# Altium schematic sheet Protection_logic.SchDoc
size A3
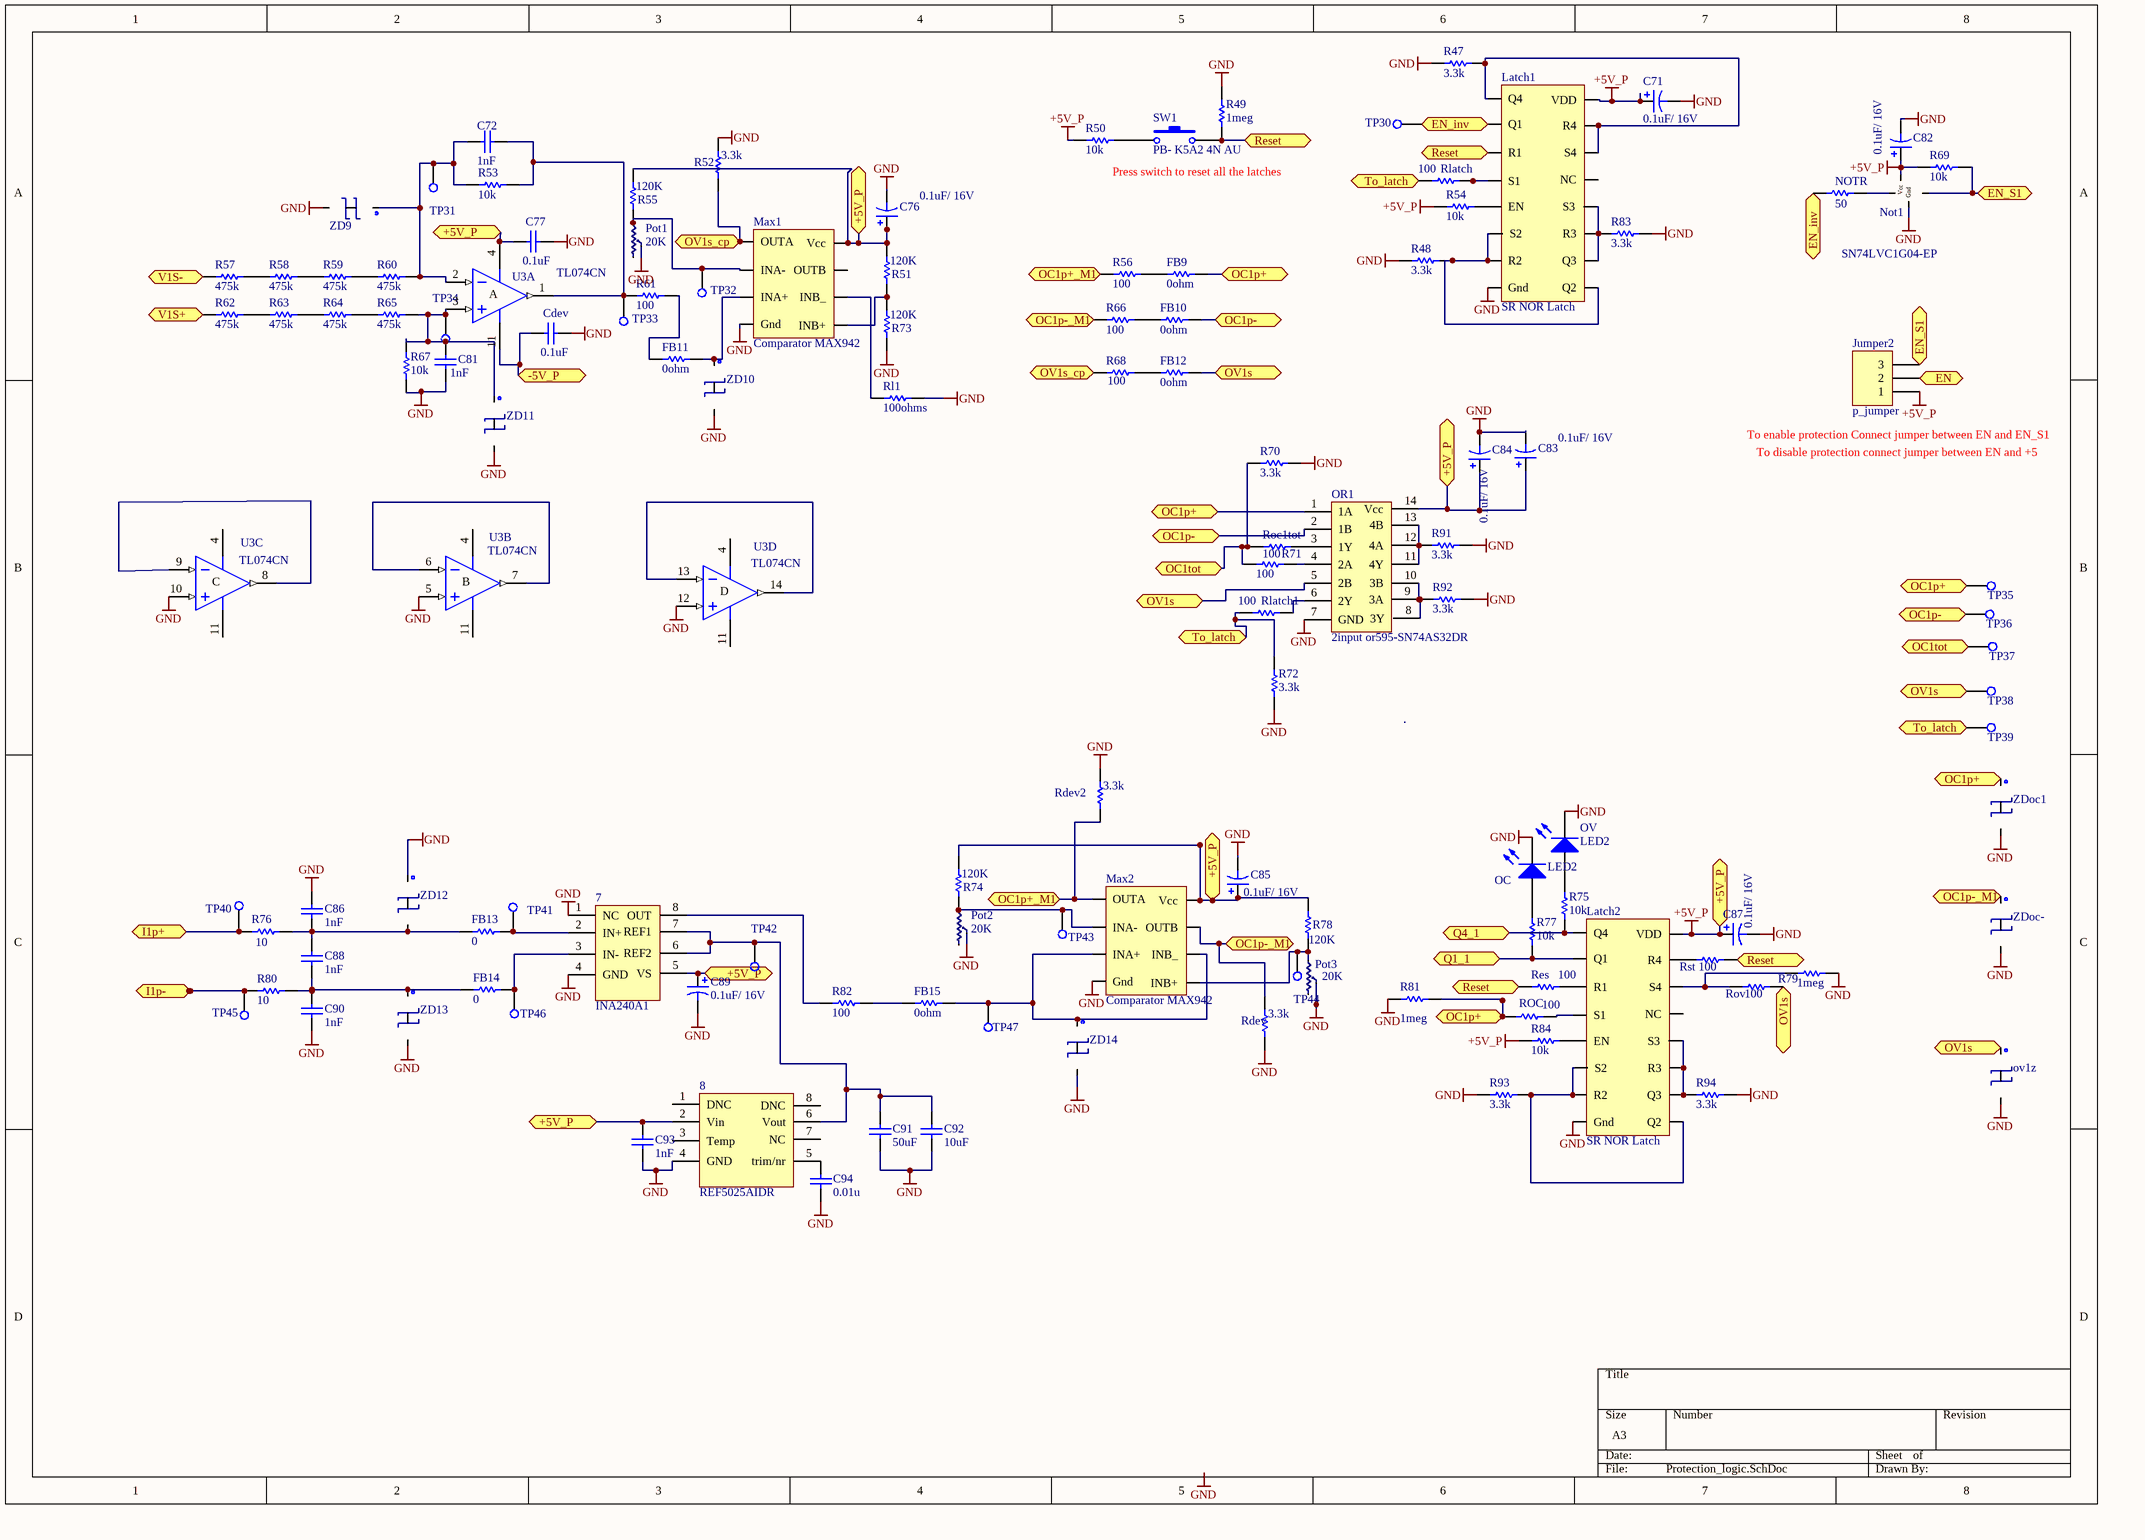
[diagram p0: Protection_logic.SchDoc]

## Parts
7  INA240A1  [INA240]
8  REF5025AIDR  [REF52.5]
C71  value 0.1uF/ 16V  [C0805]  (hidden comment: Cap Pol3)
C72  value 1nF  [C1206]  (hidden comment: 16V)
C76  value 0.1uF/ 16V  [C0805]  (hidden comment: Cap Pol3)
C77  value 0.1uF  [C1206]  (hidden comment: 16V)
C81  value 1nF  [C1206]  (hidden comment: 16V)
C82  value 0.1uF/ 16V  [C0805]  (hidden comment: Cap Pol3)
C83  value 0.1uF/ 16V  [C0805]  (hidden comment: Cap Pol3)
C84  value 0.1uF/ 16V  [C0805]  (hidden comment: Cap Pol3)
C85  value 0.1uF/ 16V  [C0805]  (hidden comment: Cap Pol3)
C86  value 1nF  [C1206]  (hidden comment: 16V)
C87  value 0.1uF/ 16V  [C0805]  (hidden comment: Cap Pol3)
C88  value 1nF  [C1206]  (hidden comment: 16V)
C89  value 0.1uF/ 16V  [C0805]  (hidden comment: Cap Pol3)
C90  value 1nF  [C1206]  (hidden comment: 16V)
C91  value 50uF  [C1206]  (hidden comment: 16V)
C92  value 10uF  [C1206]  (hidden comment: 16V)
C93  value 1nF  [C1206]  (hidden comment: 16V)
C94  value 0.01u  [C1206]  (hidden comment: 16V)
Cdev  value 0.1uF  [C1206]  (hidden comment: 16V)
FB9  res_smd  [res_smd]  (value not drawn)
FB10  res_smd  [res_smd]  (value not drawn)
FB11  res_smd  [res_smd]  (value not drawn)
FB12  res_smd  [res_smd]  (value not drawn)
FB13  res_smd  [res_smd]  (value not drawn)
FB14  res_smd  [res_smd]  (value not drawn)
FB15  res_smd  [res_smd]  (value not drawn)
Jumper2  p_jumper  [Header1*3]
Latch1  SR NOR Latch  [SR latch]
Latch2  SR NOR Latch  [SR latch]
Max1  Comparator MAX942  [SOIC 8_ no EP]
Max2  Comparator MAX942  [SOIC 8_ no EP]
Not1  SN74LVC1G04-EP  [Inverter]
NOTR  res_smd  [res_smd]  (value not drawn)
OC  LED2  [3.2X1.6X1.1]
OR1  2input or595-SN74AS32DR  [2inputor]
OV  LED2  [3.2X1.6X1.1]
ov1z  8.2 v  [Zener Diode]  (value not drawn)
Pot1  20K  [Pot]
Pot2  20K  [Pot]
Pot3  20K  [Pot]
R47  res_smd  [res_smd]  (value not drawn)
R48  res_smd  [res_smd]  (value not drawn)
R49  res_smd  [res_smd]  (value not drawn)
R50  res_smd  [res_smd]  (value not drawn)
R51  res_smd  [res_smd]  (value not drawn)
R52  res_smd  [res_smd]  (value not drawn)
R53  res_smd  [res_smd]  (value not drawn)
R54  res_smd  [res_smd]  (value not drawn)
R55  res_smd  [res_smd]  (value not drawn)
R56  res_smd  [res_smd]  (value not drawn)
R57  res_smd  [res_smd]  (value not drawn)
R58  res_smd  [res_smd]  (value not drawn)
R59  res_smd  [res_smd]  (value not drawn)
R60  res_smd  [res_smd]  (value not drawn)
R61  res_smd  [res_smd]  (value not drawn)
R62  res_smd  [res_smd]  (value not drawn)
R63  res_smd  [res_smd]  (value not drawn)
R64  res_smd  [res_smd]  (value not drawn)
R65  res_smd  [res_smd]  (value not drawn)
R66  res_smd  [res_smd]  (value not drawn)
R67  res_smd  [res_smd]  (value not drawn)
R68  res_smd  [res_smd]  (value not drawn)
R69  res_smd  [res_smd]  (value not drawn)
R70  res_smd  [res_smd]  (value not drawn)
R71  res_smd  [res_smd]  (value not drawn)
R72  res_smd  [res_smd]  (value not drawn)
R73  res_smd  [res_smd]  (value not drawn)
R74  res_smd  [res_smd]  (value not drawn)
R75  res_smd  [res_smd]  (value not drawn)
R76  res_smd  [res_smd]  (value not drawn)
R77  res_smd  [res_smd]  (value not drawn)
R78  res_smd  [res_smd]  (value not drawn)
R79  res_smd  [res_smd]  (value not drawn)
R80  res_smd  [res_smd]  (value not drawn)
R81  res_smd  [res_smd]  (value not drawn)
R82  res_smd  [res_smd]  (value not drawn)
R83  res_smd  [res_smd]  (value not drawn)
R84  res_smd  [res_smd]  (value not drawn)
R91  res_smd  [res_smd]  (value not drawn)
R92  res_smd  [res_smd]  (value not drawn)
R93  res_smd  [res_smd]  (value not drawn)
R94  res_smd  [res_smd]  (value not drawn)
Rdev  res_smd  [res_smd]  (value not drawn)
Rdev2  res_smd  [res_smd]  (value not drawn)
Res  res_smd  [res_smd]  (value not drawn)
Rl1  res_smd  [res_smd]  (value not drawn)
Rlatch  res_smd  [res_smd]  (value not drawn)
Rlatch1  res_smd  [res_smd]  (value not drawn)
ROC  res_smd  [res_smd]  (value not drawn)
Roc1tot  res_smd  [res_smd]  (value not drawn)
Rov  res_smd  [res_smd]  (value not drawn)
Rst  res_smd  [res_smd]  (value not drawn)
SW1  PB- K5A2 4N AU  [Push Button _New]
TP30  Test Point  [Test Point]  (value not drawn)
TP31  Test Point  [Test Point]  (value not drawn)
TP32  Test Point  [Test Point]  (value not drawn)
TP33  Test Point  [Test Point]  (value not drawn)
TP34  Test Point  [Test Point]  (value not drawn)
TP35  Test Point  [Test Point]  (value not drawn)
TP36  Test Point  [Test Point]  (value not drawn)
TP37  Test Point  [Test Point]  (value not drawn)
TP38  Test Point  [Test Point]  (value not drawn)
TP39  Test Point  [Test Point]  (value not drawn)
TP40  Test Point  [Test Point]  (value not drawn)
TP41  Test Point  [Test Point]  (value not drawn)
TP42  Test Point  [Test Point]  (value not drawn)
TP43  Test Point  [Test Point]  (value not drawn)
TP44  Test Point  [Test Point]  (value not drawn)
TP45  Test Point  [Test Point]  (value not drawn)
TP46  Test Point  [Test Point]  (value not drawn)
TP47  Test Point  [Test Point]  (value not drawn)
U3  TL074CN  [DIP14]  (parts A,B,C,D of 4)
ZD9  8.2 v  [Zener Diode]  (value not drawn)
ZD10  8.2 v  [Zener Diode]  (value not drawn)
ZD11  8.2 v  [Zener Diode]  (value not drawn)
ZD12  8.2 v  [Zener Diode]  (value not drawn)
ZD13  8.2 v  [Zener Diode]  (value not drawn)
ZD14  8.2 v  [Zener Diode]  (value not drawn)
ZDoc1  8.2 v  [Zener Diode]  (value not drawn)
ZDoc-  8.2 v  [Zener Diode]  (value not drawn)

## Ports
+5V_P (bidir), -5V_P (bidir), EN, EN_inv, EN_S1, I1p+, I1p-, OC1p+, OC1p+_M1, OC1p-, OC1p-_M1, OC1tot, OV1s, OV1s_cp, Q1_1, Q4_1, Reset, To_latch (bidir), V1S+, V1S-

## Nets
+5V_P: 7.5(VS) 8.2(Vin) C71.1 C76.1 C77.2 C82.1 C83.1 C84.1 C85.1 C87.1 C89.1 C93.2 Jumper2.1 Latch1.16(VDD) Latch2.16(VDD) Max1.8(Vcc) Max2.8(Vcc) Not1.5(Vcc) OR1.14(Vcc) R50.2 R51.2 R54.2 R55.2 R69.2 R74.2 R78.2 R84.2 U3.4(V+) ; port +5V_P
GND: 7.1(NC) 7.4(GND) 8.4(GND) C71.2 C76.2 C77.1 C81.2 C82.2 C83.2 C84.2 C85.2 C86.2 C87.2 C89.2 C90.1 C91.1 C92.1 C93.1 C94.1 Cdev.1 Latch1.8(Gnd) Latch2.8(Gnd) Max1.4(Gnd) Max2.4(Gnd) Not1.3(Gnd) OC.2(K) OR1.7(GND) OV.2(K) ov1z.2 Pot1.2 Pot2.2 Pot3.2 R47.2 R48.2 R49.1 R52.2 R67.2 R70.2 R72.1 R73.1 R79.1 R81.2 R83.2 R91.2 R92.2 R93.2 R94.2 Rdev.1 Rdev2.2 Rl1.1 U3.5(IN+) U3.10(IN+) U3.12(IN+) ZD9.2 ZD10.2 ZD11.2 ZD12.1 ZD13.2 ZD14.2 ZDoc1.2 ZDoc-.2
-5V_P: Cdev.2 U3.11(V-) ; port -5V_P
EN: Jumper2.2 ; port EN
EN_inv: Latch1.2(Q1) NOTR.2 TP30.1(TP?) ; port EN_inv
EN_S1: Jumper2.3 Not1.4(Y) R69.1 ; port EN_S1
I1p+: R76.2 TP40.1(TP?) ; port I1p+
I1p-: R80.2 TP45.1(TP?) ; port I1p-
OC1p+: FB9.1 OR1.1(1A) R81.1 ROC.2 TP35.1(TP?) ZDoc1.1 ; port OC1p+
OC1p+_M1: Max2.1(OUTA) R56.2 Rdev2.1 ; port OC1p+_M1
OC1p-: FB10.1 OR1.2(1B) TP36.1(TP?) ; port OC1p-
OC1p-_M1: Max2.7(OUTB) R66.2 Rdev.2 ZDoc-.1 ; port OC1p-_M1
OC1tot: R70.1 R71.2 Roc1tot.2 TP37.1(TP?) ; port OC1tot
OV1s: FB12.1 OR1.5(2B) ov1z.1 Rov.1 TP38.1(TP?) ; port OV1s
OV1s_cp: Max1.1(OUTA) R52.1 R68.2 ; port OV1s_cp
Q1_1: Latch2.2(Q1) R77.1 ; port Q1_1
Q4_1: Latch2.1(Q4) R75.1 ; port Q4_1
Reset: Latch1.3(R1) R49.2 Res.2 Rst.1 SW1.2 ; port Reset
To_latch: R72.2 Rlatch.2 Rlatch1.2 TP39.1(TP?) ; port To_latch
V1S+: R62.2 ; port V1S+
V1S-: R57.2 ; port V1S-
Net7_2: 7.2(IN+) FB13.1 TP41.1(TP?)
Net7_3: 7.3(IN-) FB14.1 TP46.1(TP?)
Net7_6: 7.6(REF2) 7.7(REF1) 8.6(Vout) C91.2 C92.2 TP42.1(TP?)
Net7_8: 7.8(OUT) R82.2
Net8_5: 8.5(trim/nr) C94.2
NetC72_1: C72.1 R53.1 R61.2 TP33.1(TP?) U3.1(OUT)
NetC72_2: C72.2 R53.2 R60.1 TP31.1(TP?) U3.2(IN-) ZD9.1
NetC81_1: C81.1 R65.1 R67.1 TP34.1(TP?) U3.3(IN+) ZD11.1
NetC86_1: C86.1 C88.2 FB13.2 R76.1 ZD12.2
NetC88_1: C88.1 C90.2 FB14.2 R80.1 ZD13.1
NetFB9_2: FB9.2 R56.1
NetFB10_2: FB10.2 R66.1
NetFB11_1: FB11.1 Max1.3(INA+) ZD10.1
NetFB11_2: FB11.2 R61.1
NetFB12_2: FB12.2 R68.1
NetFB15_1: FB15.1 Max2.3(INA+) Max2.6(INB_) TP47.1(TP?) ZD14.1
NetFB15_2: FB15.2 R82.1
NetLatch1_1: Latch1.1(Q4) Latch1.14(S4) Latch1.15(R4) R47.1
NetLatch1_4: Latch1.4(S1) Rlatch.1
NetLatch1_5: Latch1.5(EN) R54.1
NetLatch1_6: Latch1.6(S2) Latch1.7(R2) Latch1.9(Q2) R48.1
NetLatch1_10: Latch1.10(Q3) Latch1.11(R3) Latch1.12(S3) R83.1
NetLatch2_3: Latch2.3(R1) Res.1
NetLatch2_4: Latch2.4(S1) ROC.1
NetLatch2_5: Latch2.5(EN) R84.1
NetLatch2_6: Latch2.6(S2) Latch2.7(R2) Latch2.9(Q2) R93.1
NetLatch2_10: Latch2.10(Q3) Latch2.11(R3) Latch2.12(S3) R94.1
NetLatch2_14: Latch2.14(S4) R79.2 Rov.2
NetLatch2_15: Latch2.15(R4) Rst.2
NetMax1_2: Max1.2(INA-) Pot1.1 R55.1 TP32.1(TP?)
NetMax1_5: Max1.5(INB+) R51.1 R73.2
NetMax1_6: Max1.6(INB_) Rl1.2
NetMax2_2: Max2.2(INA-) Pot2.1 R74.1 TP43.1(TP?)
NetMax2_5: Max2.5(INB+) Pot3.1 R78.1 TP44.1(TP?)
NetNot1_2: Not1.2(A) NOTR.1
NetOC_1: OC.1(A) R77.2
NetOR1_3: OR1.3(1Y) Roc1tot.1
NetOR1_4: OR1.4(2A) R71.1
NetOR1_6: OR1.6(2Y) Rlatch1.1
NetOR1_8: OR1.8(3Y) OR1.9(3A) OR1.10(3B) R92.1
NetOR1_11: OR1.11(4Y) OR1.12(4A) OR1.13(4B) R91.1
NetOV_1: OV.1(A) R75.2
NetR50_1: R50.1 SW1.1
NetR57_1: R57.1 R58.2
NetR58_1: R58.1 R59.2
NetR59_1: R59.1 R60.2
NetR62_1: R62.1 R63.2
NetR63_1: R63.1 R64.2
NetR64_1: R64.1 R65.2
NetU3_6: U3.6(IN-) U3.7(OUT)
NetU3_8: U3.8(OUT) U3.9(IN-)
NetU3_13: U3.13(IN-) U3.14(OUT)

Not connected (* = marked no-connect by the designer): 8 1(DNC) 3(Temp) 7(NC) 8(DNC); Latch1 13(NC); Latch2 13(NC); Max1 7(OUTB); ov1z 3; Pot1 3; Pot2 3; Pot3 3; ZD9 3; ZD10 3; ZD11 3; ZD12 3; ZD13 3; ZD14 3; ZDoc1 3; ZDoc- 3

## Notes on the sheet
- Press switch to reset all the latches
- (near Jumper2) To enable protection Connect jumper between EN and EN_S1
- To disable protection connect jumper between EN and +5
- Labels drawn without touching a wire or pin: GND
- (in symbol res_smd) 100; 475k; 10k; 120K; 1meg; 3.3k; 10; 0; 0ohm; 50; 100ohms
- (in symbol TL074J, part A) A
- (in symbol TL074J, part B) B
- (in symbol TL074J, part C) C
- (in symbol TL074J, part D) D

## Library data of the parts
7 = ina240: GAIN 20
C71 C76 C82-C85 C87 C89 = Cap Pol3: Polarized Capacitor (Surface Mount); Published: 8-Jun-2000; LatestRevisionDate: 29-May-2009; LatestRevisionNote: IPC-7351 Footprint Added.; PackageReference: C0805; Publisher: Altium Limited; PackageDescription: Chip Capacitor
C72 C77 C81 C86 C88 C90-C94 Cdev = Cap Semi: Capacitor (Semiconductor SIM Model); Published: 8-Jun-2000; LatestRevisionDate: 29-May-2009; LatestRevisionNote: IPC-7351 Footprint Added.; PackageReference: C1206; Publisher: Altium Limited; PackageDescription: Chip Capacitor
FB9-FB15 NOTR R47-R84 R91-R94 Rdev Rdev2 Res Rl1 Rlatch Rlatch1 ROC Roc1tot Rov Rst = res_smd: smd_res
Latch1 Latch2 = SR Latch: CD4043BDR
Max1 Max2 = Max942: MAX942ESA+
Not1 = Inverter
OC OV = LED2: Typical RED, GREEN, YELLOW, AMBER GaAs LED; Published: 8-Jun-2000; LatestRevisionDate: 17-Jul-2002; LatestRevisionNote: Re-released for DXP Platform.; PackageVersion: Feb-2002; PackageReference: 3.2X1.6X1.1; Publisher: Altium Limited; PackageDescription: SM LED; 2 Flat Leads
OR1 = 2 input OR
ov1z ZD9-ZD14 ZDoc1 ZDoc- = Zener_diode: DZ23C8V2-7-F
Pot1-Pot3 = TRIM POT: 3296W-1-253LF
SW1 = SW-PB: Switch; Published: 24-Mar-1999; Revision: July-2002: Re-released for DXP Platform.; Publisher: Altium Limited
U3 = TL074J: Low-Noise JFET-Input Operational Amplifier; Published: 16-Jan-2001; LatestRevisionDate: 04-Mar-2005; LatestRevisionNote: Stylized 3D Model Added.; DatasheetVersion: Aug-1996; PackageVersion: Jun-1999; PackageReference: J014; Publisher: Altium Limited; PackageDescription: DIP; 14 Leads; Row Spacing 7.62 mm; Pitch 2.54 mm; ComponentLink1Description: Manufacturer Link; ComponentLink1URL: http://www.ti.com/; ComponentLink2Description: Datasheet; ComponentLink2URL: http://www-s.ti.com/sc/ds/tl074.pdf